# Altium schematic sheet BluePitch.SchDoc
size A4
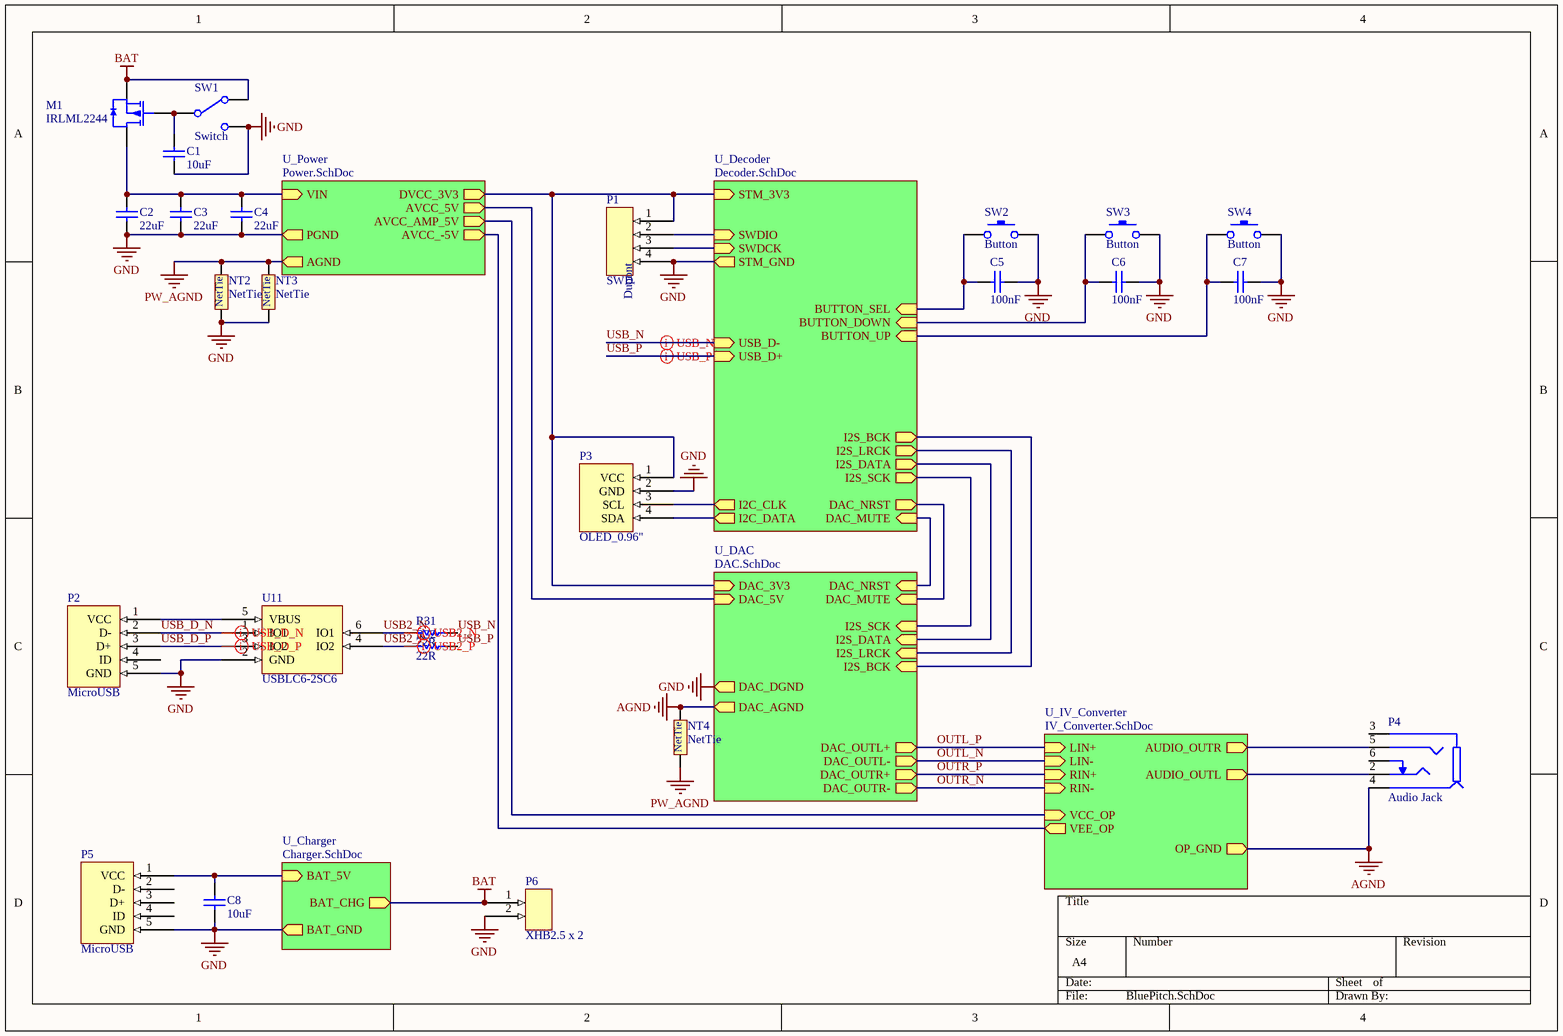
[diagram p0: BluePitch.SchDoc]

## Parts
C1  10uF  [SMC_0805]
C2  22uF  [SMC_1206]
C3  22uF  [SMC_1206]
C4  22uF  [SMC_1206]
C5  100nF  [SMC_0402]
C6  100nF  [SMC_0402]
C7  100nF  [SMC_0402]
C8  10uF  [SMC_0805]
M1  IRLML2244  [SOT95P237X112-3N]
NT2  NetTie  [NT_20]  (net tie, no BOM)
NT3  NetTie  [NT_20]  (net tie, no BOM)
NT4  NetTie  [NT_20]  (net tie, no BOM)
P1  SWD  [Dupont Female x 4]
P2  MicroUSB  [MicroUSB]
P3  OLED_0.96"  [OLED 0.96"]
P4  Audio Jack  [PJ-327A]
P5  MicroUSB  [MicroUSB]
P6  XHB2.5 x 2  [XHB2.5 x 2]
R31  22R  [SMR_0402]
R32  22R  [SMR_0402]
SW1  Switch  [Switch]
SW2  Button  [Button]
SW3  Button  [Button]
SW4  Button  [Button]
U11  USBLC6-2SC6  [SOT95P280X145-6N]

## Sub-sheets
U_Charger = Charger.SchDoc: BAT_5V (in), BAT_CHG (out), BAT_GND (out)
U_DAC = DAC.SchDoc: I2S_LRCK (in), I2S_DATA (in), I2S_BCK (in), I2S_SCK (in), DAC_MUTE (in), DAC_OUTL- (out), DAC_OUTL+ (out), DAC_OUTR- (out), DAC_OUTR+ (out), DAC_NRST (in), DAC_3V3 (in), DAC_DGND (out), DAC_AGND (out), DAC_5V (in)
U_Decoder = Decoder.SchDoc: I2S_DATA (out), I2S_LRCK (out), I2S_BCK (out), I2S_SCK (out), USB_D+ (in), USB_D- (in), SWDIO (in), SWDCK (in), I2C_CLK (out), I2C_DATA (out), STM_3V3 (in), STM_GND (out), BUTTON_UP (in), BUTTON_DOWN (in), BUTTON_SEL (in), DAC_MUTE (in), DAC_NRST (out)
U_IV_Converter = IV_Converter.SchDoc: AUDIO_OUTL (out), LIN+ (in), LIN- (in), AUDIO_OUTR (out), RIN+ (in), RIN- (in), VCC_OP (in), OP_GND (out), VEE_OP (out)
U_Power = Power.SchDoc: DVCC_3V3 (out), PGND (out), AGND (out), VIN (in), AVCC_-5V (out), AVCC_5V (out), AVCC_AMP_5V (out)

## Nets
AGND: NT4.2 P4.4(SLEEVE/L) ; sheet U_DAC/DAC_AGND, sheet U_IV_Converter/OP_GND
BAT: M1.S P6.1 SW1.2 ; sheet U_Charger/BAT_CHG
GND: C1.1 C2.1 C3.1 C4.1 C5.2 C6.2 C7.2 C8.1 NT2.1 NT3.1 P1.4 P2.5(GND) P3.2(GND) P5.5(GND) P6.2 SW1.3 SW2.2 SW3.2 SW4.2 U11.2(GND) ; sheet U_DAC/DAC_DGND, sheet U_Decoder/STM_GND, sheet U_Power/PGND, sheet U_Charger/BAT_GND
PW_AGND: NT2.2 NT3.2 NT4.1 ; sheet U_Power/AGND
OUTL_N: sheet U_DAC/DAC_OUTL-, sheet U_IV_Converter/LIN-
OUTL_P: sheet U_DAC/DAC_OUTL+, sheet U_IV_Converter/LIN+
OUTR_N: sheet U_DAC/DAC_OUTR-, sheet U_IV_Converter/RIN-
OUTR_P: sheet U_DAC/DAC_OUTR+, sheet U_IV_Converter/RIN+
USB2_N: R31.1 U11.6(IO1)
USB2_P: R32.1 U11.4(IO2)
USB_D_N: P2.2(D-) U11.1(IO1)
USB_D_P: P2.3(D+) U11.3(IO2)
USB_N: R31.2 ; sheet U_Decoder/USB_D-
USB_P: R32.2 ; sheet U_Decoder/USB_D+
NetC1_2: C1.2 M1.G SW1.1
NetC2_2: C2.2 C3.2 C4.2 M1.D ; sheet U_Power/VIN
NetC5_1: C5.1 SW2.1 ; sheet U_Decoder/BUTTON_SEL
NetC6_1: C6.1 SW3.1 ; sheet U_Decoder/BUTTON_DOWN
NetC7_1: C7.1 SW4.1 ; sheet U_Decoder/BUTTON_UP
NetC8_2: C8.2 P5.1(VCC) ; sheet U_Charger/BAT_5V
NetP1_1: P1.1 P3.1(VCC) ; sheet U_DAC/DAC_3V3, sheet U_Decoder/STM_3V3, sheet U_Power/DVCC_3V3
NetP1_2: P1.2 ; sheet U_Decoder/SWDIO
NetP1_3: P1.3 ; sheet U_Decoder/SWDCK
NetP2_1: P2.1(VCC) U11.5(VBUS)
NetP3_3: P3.3(SCL) ; sheet U_Decoder/I2C_CLK
NetP3_4: P3.4(SDA) ; sheet U_Decoder/I2C_DATA
NetP4_2: P4.2(L) ; sheet U_IV_Converter/AUDIO_OUTL
NetP4_5: P4.5(R) ; sheet U_IV_Converter/AUDIO_OUTR
(unnamed): sheet U_DAC/I2S_LRCK, sheet U_Decoder/I2S_LRCK
(unnamed): sheet U_DAC/I2S_DATA, sheet U_Decoder/I2S_DATA
(unnamed): sheet U_DAC/I2S_BCK, sheet U_Decoder/I2S_BCK
(unnamed): sheet U_DAC/I2S_SCK, sheet U_Decoder/I2S_SCK
(unnamed): sheet U_DAC/DAC_MUTE, sheet U_Decoder/DAC_NRST
(unnamed): sheet U_DAC/DAC_NRST, sheet U_Decoder/DAC_MUTE
(unnamed): sheet U_DAC/DAC_5V, sheet U_Power/AVCC_5V
(unnamed): sheet U_IV_Converter/VCC_OP, sheet U_Power/AVCC_AMP_5V
(unnamed): sheet U_IV_Converter/VEE_OP, sheet U_Power/AVCC_-5V

Not connected (* = marked no-connect by the designer): P2 4(ID); P4 3(SLEEVE) 6(CONT); P5 2(D-) 3(D+) 4(ID)

## Layout directives
differential pair: USB2_N, USB2_P, USB_D_N, USB_D_P, USB_N, USB_P

## Notes on the sheet
- (in symbol Dupont Header x 4) Dupont

## Library data of the parts
C1-C8 = Cap Ceramic
P1 = Dupont Header x 4
R31 R32 = Res SMT